# EAGLE schematic LightUpATtiny13 (EAGLE 7.6.0)
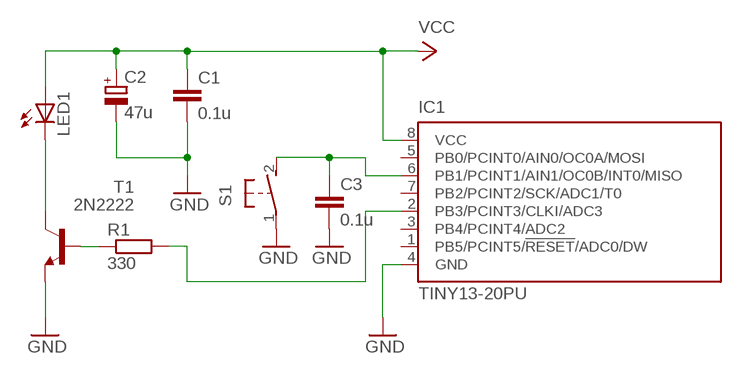
[diagram p0: schematic, sheet 1]

## Parts
C1  0.1u  C-EU025-025X050  [C025-025X050]
C2  47u  CPOL-EUE2-5  [E2-5]
C3  0.1u  C-EU025-025X050  [C025-025X050]
IC1  TINY13-20PU  [DIL08]
LED1  LEDSQR2X5  [LED2X5]
R1  330  R-EU_0411/12  [0411/12]
S1  31-XX  [B3F-31XX]
T1  2N2222  [TO18]

## Nets
GND: C1.2 C2.- C3.2 IC1.4(GND) S1.1(P) T1.1(E)
N$1: IC1.2(PB3/PCINT3/CLKI/ADC3) R1.2
N$2: R1.1 T1.2(B)
N$3: LED1.K(C) T1.3(C)
N$5: C3.1 IC1.6(PB1/PCINT1/AIN1/OC0B/INT0/MISO) S1.2(S)
VCC: C1.1 C2.+ IC1.8(VCC) LED1.A
Unconnected: IC1.1(PB5/PCINT5/!RESET!/ADC0/DW) IC1.3(PB4/PCINT4/ADC2) IC1.5(PB0/PCINT0/AIN0/OC0A/MOSI) IC1.7(PB2/PCINT2/SCK/ADC1/T0)

## Library data of the parts
C1 C3 = rcl:C-EU: CAPACITOR, European symbol
C2 = rcl:CPOL-EU: POLARIZED CAPACITOR, European symbol
IC1 = atmel:TINY13: 8-bit AVR Microcontroller with 1K Bytes In-System Programmable Flash Source: http://www.atmel.com/dyn/resources/prod_documents/2535S.pdf; MPN: ATTINY13-20PU; OC_FARNELL: 9171550; OC_NEWARK: 96K6521
LED1 = led:LED: LED OSRAM: - CHIPLED LG R971, LG N971, LY N971, LG Q971, LY Q971, LO R971, LY R971 LH N974, LH R974 LS Q976, LO Q976, LY Q976 LO Q996 - Hyper CHIPLED LW Q18S LB Q993, LB Q99A, LB R99A - SideLED LS A670, LO A670, LY A670, LG A670, LP A670 LB A673, LV A673, LT A673, LW A673 LH A674 LY A675 LS A676, LA A676, LO A676, LY A676, LW A676 LS A679, LY A679, LG A679 - Hyper Micro SIDELED® LS Y876, LA Y876, LO Y876, LY Y876 LT Y87S - SmartLED LW L88C, LW L88S LB L89C, LB L89S, LG L890 LS L89K, LO L89K, LY L89K LS L896, LA L896, LO L896, LY L896 - TOPLED LS T670, LO T670, LY T670, LG T670, LP T670 LSG T670, LSP T670, LSY T670, LOP T670, LYG T670 LG T671, LOG T671, LSG T671 LB T673, LV T673, LT T673, LW T673 LH T674 LS T676, LA T676, LO T676, LY T676, LB T676, LH T676, LSB T676, LW T676 LB T67C, LV T67C, LT T67C, LS T67K, LO T67K, LY T67K, LW E67C LS E67B, LA E67B, LO E67B, LY E67B, LB E67C, LV E67C, LT E67C LW T67C LS T679, LY T679, LG T679 LS T770, LO T770, LY T770, LG T770, LP T770 LB T773, LV T773, LT T773, LW T773 LH T774 LS E675, LA E675, LY E675, LS T675 LS T776, LA T776, LO T776, LY T776, LB T776 LHGB T686 LT T68C, LB T68C - Hyper Mini TOPLED® LB M676 - Mini TOPLED Santana® LG M470 LS M47K, LO M47K, LY M47K Source: http://www.osram.convergy.de LUXEON: - LUMILED® LXK2-PW12-R00, LXK2-PW12-S00, LXK2-PW14-U00, LXK2-PW14-V00 LXK2-PM12-R00, LXK2-PM12-S00, LXK2-PM14-U00 LXK2-PE12-Q00, LXK2-PE12-R00, LXK2-PE12-S00, LXK2-PE14-T00, LXK2-PE14-U00 LXK2-PB12-K00, LXK2-PB12-L00, LXK2-PB12-M00, LXK2-PB14-N00, LXK2-PB14-P00, LXK2-PB14-Q00 LXK2-PR12-L00, LXK2-PR12-M00, LXK2-PR14-Q00, LXK2-PR14-R00 LXK2-PD12-Q00, LXK2-PD12-R00, LXK2-PD12-S00 LXK2-PH12-R00, LXK2-PH12-S00 LXK2-PL12-P00, LXK2-PL12-Q00, LXK2-PL12-R00 Source: www.luxeon.com KINGBRIGHT: KA-3528ASYC Source: www.kingbright.com
R1 = resistor:R-EU_: RESISTOR, European symbol
S1 = switch-omron:31-XX: OMRON SWITCH; MPN: B3F-3100; OC_FARNELL: 959704; OC_NEWARK: 36M3582
T1 = transistor-neu-to92:2N2222: NPN TRANSISTOR